# EAGLE design DDSBeeTQFP (EAGLE 6.4)
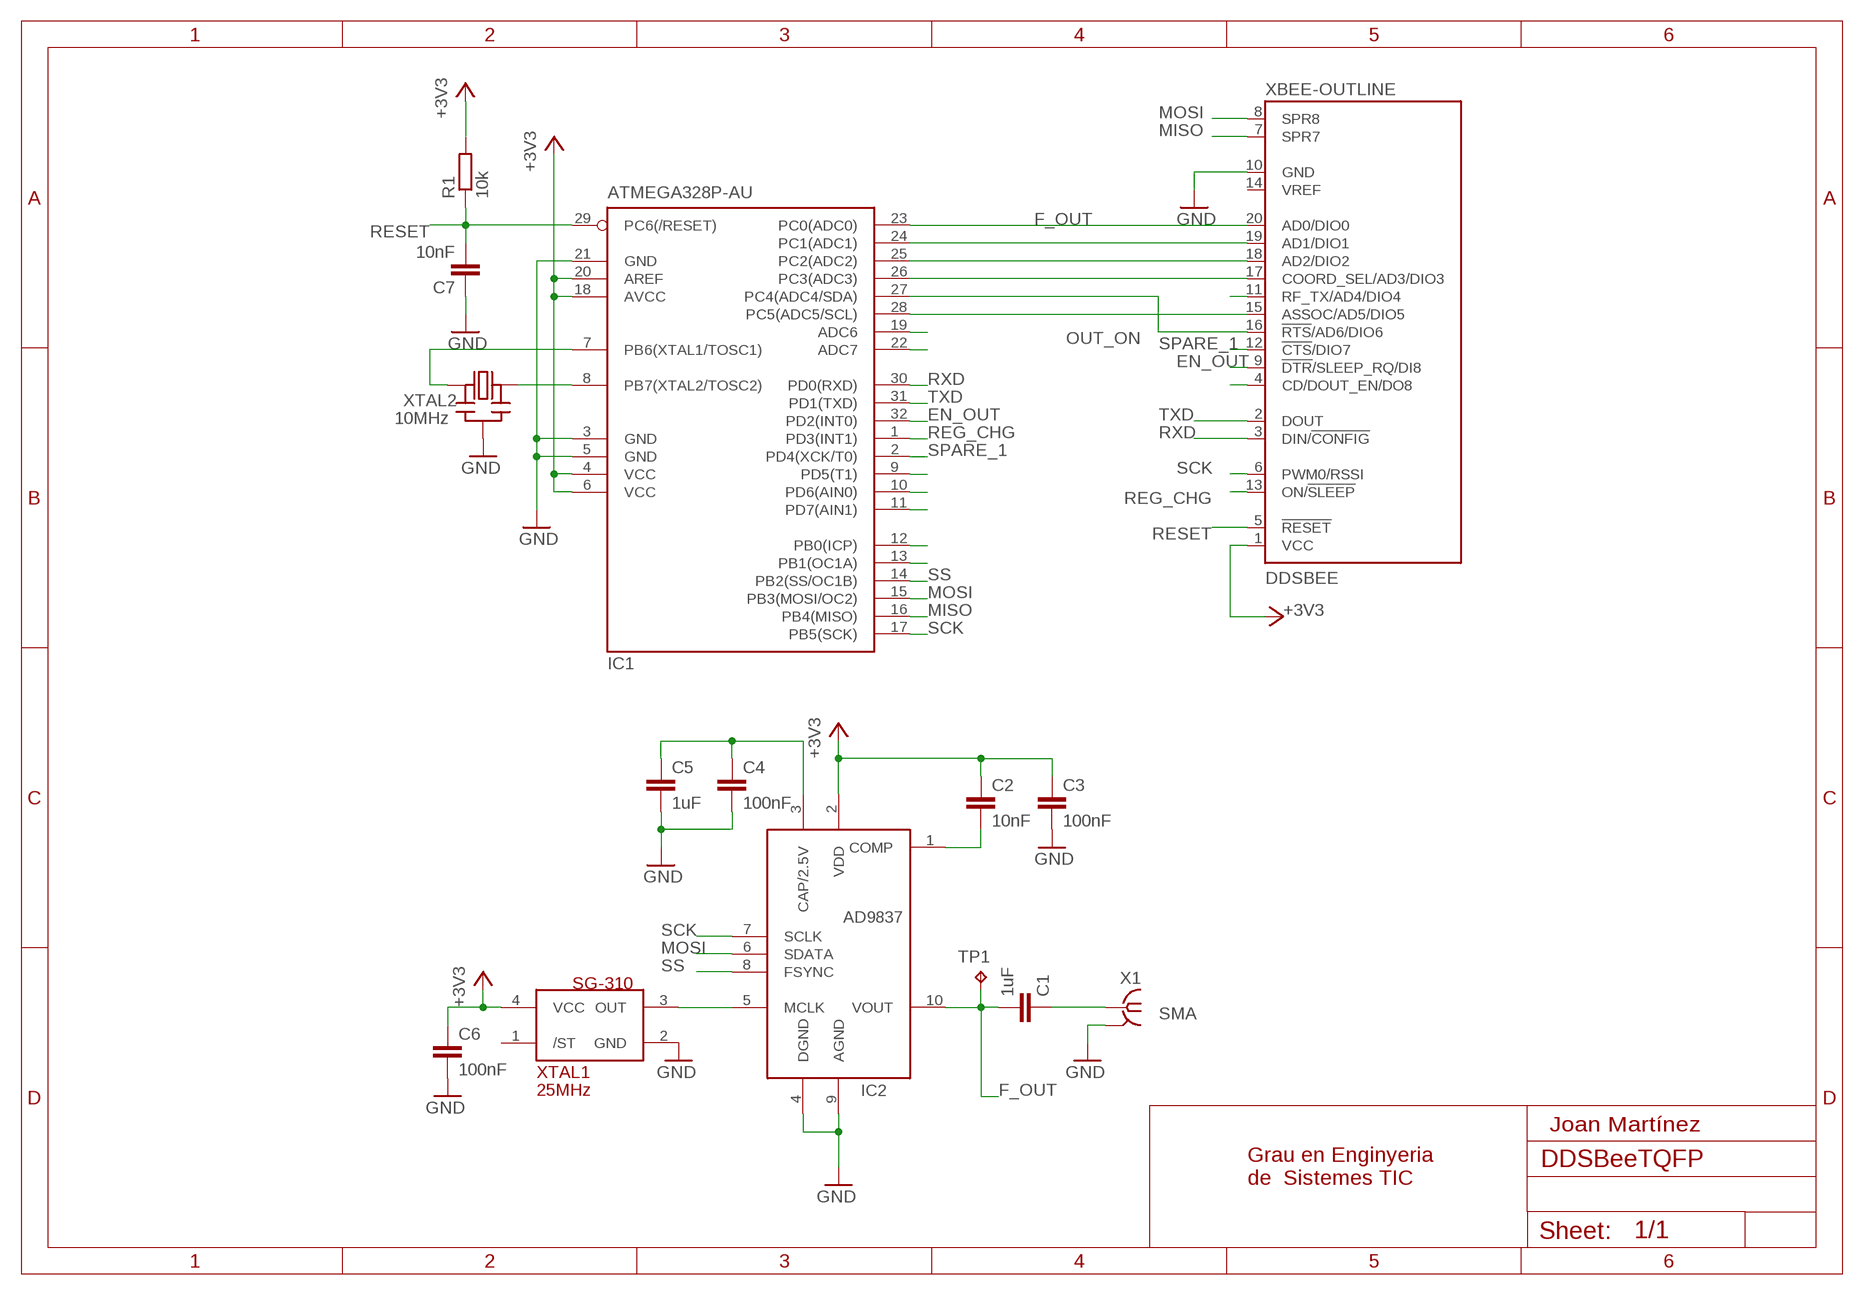
[diagram p0: schematic, sheet 1]

## Parts
C1  1uF  C-EUC0805  [C0805]
C2  10nF  C-EUC0805  [C0805]
C3  100nF  C-EUC0805  [C0805]
C4  100nF  C-EUC0805  [C0805]
C5  1uF  C-EUC0805  [C0805]
C6  100nF  C-EUC0805  [C0805]
C7  10nF  C-EUC0805  [C0805]
DDSBEE  XBEE-OUTLINE  [XBEE-PRO-DIM]
IC1  ATMEGA328P-AU  MEGA8-AI  [TQFP32-08]
IC2  AD9833  [MSOP10]
R1  10k  R-EU_R0805  [R0805]
TP1  TPTP15R  [TP15R]
X1  SMA  SMA-142-0701-871/876  [J502-ND-142-0701-871/876]
XTAL1  25MHz  SG-310-SCN  [EF241A]
XTAL2  10MHz  CERMOSCILL-CERALOCK  [CERALOCK]

## Nets
+3V3: C2.1 C3.1 C6.1 DDSBEE.1(VCC) IC1.4(VCC) IC1.6(VCC) IC1.18(AVCC) IC1.20(AREF) IC2.2(VDD) R1.2 XTAL1.4(VCC)
EN_OUT: DDSBEE.9(!DTR!/SLEEP_RQ/DI8) IC1.32(PD2(INT0))
F_CON: C1.1 X1.1
F_OUT: C1.2 DDSBEE.20(AD0/DIO0) IC1.23(PC0(ADC0)) IC2.10(VOUT) TP1.TP
GND: C3.2 C4.2 C5.2 C6.2 C7.1 DDSBEE.10(GND) IC1.3(GND) IC1.5(GND) IC1.21(GND) IC2.4(DGND) IC2.9(AGND) X1.G@1(GND) XTAL1.2(GND) XTAL2.P$2(GND)
MISO: DDSBEE.7(SPR7) IC1.16(PB4(MISO))
MOSI: DDSBEE.8(SPR8) IC1.15(PB3(MOSI/OC2)) IC2.6(SDATA)
N$2: IC1.8(PB7(XTAL2/TOSC2)) XTAL2.P$3(IN)
N$3: C2.2 IC2.1(COMP)
N$4: IC1.13(PB1(OC1A))
N$5: C4.1 C5.1 IC2.3(CAP/2.5V)
N$6: IC1.7(PB6(XTAL1/TOSC1)) XTAL2.P$1(OUT)
N$7: IC2.5(MCLK) XTAL1.3(OUT)
N$11: IC1.9(PD5(T1))
N$12: IC1.10(PD6(AIN0))
N$13: IC1.11(PD7(AIN1))
N$14: IC1.12(PB0(ICP))
N$21: DDSBEE.15(ASSOC/AD5/DIO5) IC1.28(PC5(ADC5/SCL))
N$22: IC1.19(ADC6)
N$23: IC1.22(ADC7)
N$25: DDSBEE.19(AD1/DIO1) IC1.24(PC1(ADC1))
N$26: DDSBEE.18(AD2/DIO2) IC1.25(PC2(ADC2))
N$27: DDSBEE.17(COORD_SEL/AD3/DIO3) IC1.26(PC3(ADC3))
N$28: DDSBEE.11(RF_TX/AD4/DIO4)
N$33: DDSBEE.4(CD/DOUT_EN/DO8)
OUT_ON: DDSBEE.16(!RTS!/AD6/DIO6) IC1.27(PC4(ADC4/SDA))
REG_CHG: DDSBEE.13(ON/!SLEEP) IC1.1(PD3(INT1))
RESET: C7.2 DDSBEE.5(!RESET) IC1.29(PC6(/RESET)) R1.1
RXD: DDSBEE.3(DIN/!CONFIG) IC1.30(PD0(RXD))
SCK: DDSBEE.6(PWM0/RSSI) IC1.17(PB5(SCK)) IC2.7(SCLK)
SPARE_1: DDSBEE.12(!CTS!/DIO7) IC1.2(PD4(XCK/T0))
SS: IC1.14(PB2(SS/OC1B)) IC2.8(FSYNC)
TXD: DDSBEE.2(DOUT) IC1.31(PD1(TXD))
Unconnected: DDSBEE.14(VREF) XTAL1.1(/ST)

## Notes on the sheet
- Joan Martínez
- Grau en Enginyeria 
  de  Sistemes TIC

## Power pins joined to a net without a drawn wire
GND: X1.G@2(GND) X1.G@3(GND) X1.G@4(GND)

## Library data of the parts
C1-C6 = rcl:C-EU: CAPACITOR, European symbol
C7 = resistor:C-EU: CAPACITOR, European symbol
DDSBEE = mylib:XBEE-OUTLINE: XBee (TM) /XBee-PRO(TM) OEM RF Modules Source: MaxStream, Inc. xbee_productmanual.pdf
IC1 = atmel:MEGA8: MICROCONTROLLER 8 Kbytes FLASH, 1 kbytes SRAM, 512 bytes EEPROM, USART, 6-channel 10 bit ADC, 2-channel 8 bit ADC Pin compatible with Atmega48, ATMega88, ATMega168 Source: avr.lbr; MPN: ATMEGA8-16AU; OC_FARNELL: 9171371; OC_NEWARK: 73M8863
IC2 = bitinnova:AD9833: DDS AD9833 Low Power, 12.65 mW, 2.3 V to 5.5 V, Programmable Waveform Generator 0 MHz to 12.5 MHz output frequency range 28-bit resolution: 0.1 Hz at 25 MHz reference clock Sinusoidal, triangular, and square wave outputs 2.3 V to 5.5 V power supply
R1 = resistor:R-EU_: RESISTOR, European symbol
TP1 = testpad:TP: Test pad
X1 = con-coax:SMA-: SMA 50 Ohm End Launch Jack Receptacle - Round Contact Johnson Components Source: www.johnsoncomponents.com .. J502-ND.pdf; MF: JOHNSON COMPONENTS; MPN: 142-0701-871; OC_FARNELL: 1339835; OC_NEWARK: 91B6105
XTAL1 = bitinnova:SG-310-SCN: SG - 310 series CRYSTAL OSCILLATOR SPXO 3.3V
XTAL2 = adafruit:CERMOSCILL: Ceramic oscillator with built in capacitors such as ZTT-12MHz http://www.ladyada.net/library/eagle

## Board
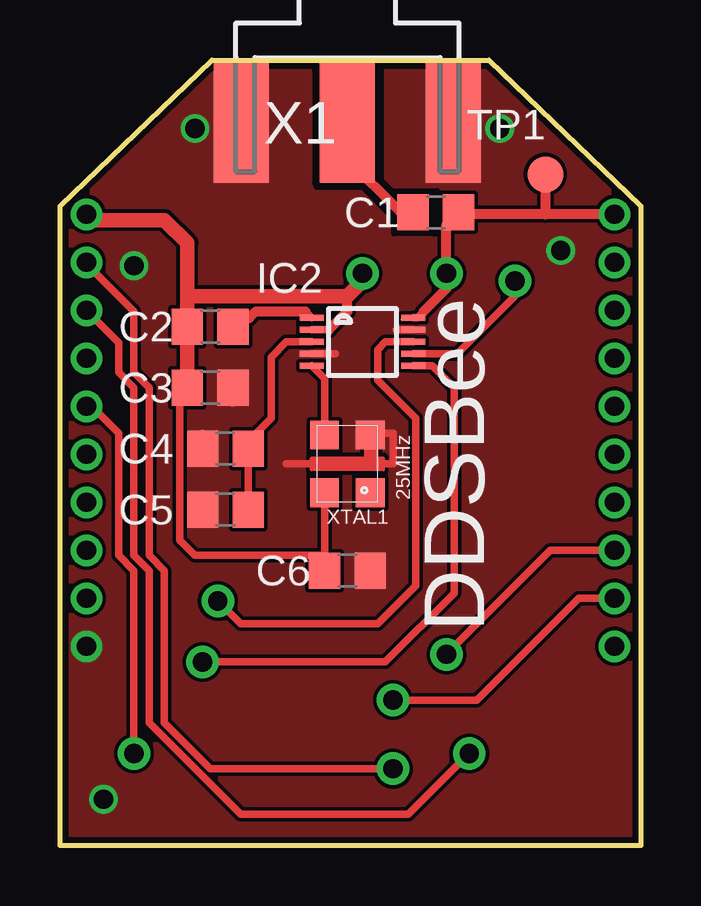
[diagram p1: board, top side]
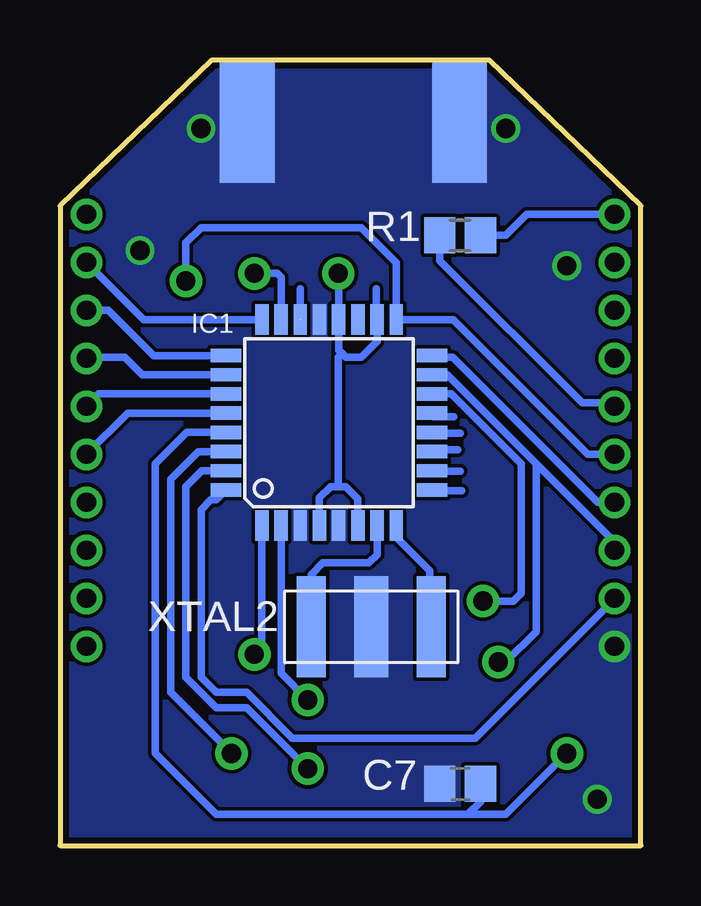
[diagram p2: board, bottom side, seen from below]

Size 24.2 x 32.74 mm. Coordinates in mm from the lower left corner, seen from the top.
Copper layers (1*16): Top 0.035mm / dielectric 1.5mm / Bottom 0.035mm
Design rules "Fusion_eagle_rule_v1.1": minimum track width 6mil, minimum drill 12mil, track to track 6mil, track to pad 6mil, pad to pad 6mil, via to via 6mil, smd to smd 0mil, copper to edge 10mil, drill to drill 10mil, minimum pad ring 10mil, minimum via ring 6mil, stop-mask expansion 2mil, vias tented up to drill 100mil, thermal gap 10mil
tRestrict: 8 lines

### Footprints (pad centres in the part's own frame; a part is rotated, then mirrored left to right if it is on the bottom)
C0805 = smd 1.3 x 1.5: 1 -0.95,0; 2 0.95,0
C0805' = smd 1.3 x 1.5: 1 -0.85,0; 2 0.85,0
XBEE-PRO-DIM = drill 0.8 pad 1.27: 1 -11,9; 2 -11,7; 3 -11,5; 4 -11,3; 5 -11,1; 6 -11,-1; 7 -11,-3; 8 -11,-5; 9 -11,-7; 10 -11,-9; 11 11,-9; 12 11,-7; 13 11,-5; 14 11,-3; 15 11,-1; 16 11,1; 17 11,3; 18 11,5; 19 11,7; 20 11,9
TQFP32-08 = smd 1.27 x 0.559: 1 -4.293,2.8; 2 -4.293,2; 3 -4.293,1.2; 4 -4.293,0.4; 5 -4.293,-0.4; 6 -4.293,-1.2; 7 -4.293,-2; 8 -4.293,-2.8; 17 4.293,-2.8; 18 4.293,-2; 19 4.293,-1.2; 20 4.293,-0.4; 21 4.293,0.4; 22 4.293,1.2; 23 4.293,2; 24 4.293,2.8 | smd 0.559 x 1.27: 9 -2.8,-4.293; 10 -2,-4.293; 11 -1.2,-4.293; 12 -0.4,-4.293; 13 0.4,-4.293; 14 1.2,-4.293; 15 2,-4.293; 16 2.8,-4.293; 25 2.8,4.293; 26 2,4.293; 27 1.2,4.293; 28 0.4,4.293; 29 -0.4,4.293; 30 -1.2,4.293; 31 -2,4.293; 32 -2.8,4.293
MSOP10 = smd 0.25 x 1: 1 -1,-2.113; 2 -0.5,-2.113; 3 0,-2.113; 4 0.5,-2.113; 5 1,-2.113; 6 1,2.113; 7 0.5,2.113; 8 0,2.113; 9 -0.5,2.113; 10 -1,2.113
R0805 = smd 1.3 x 1.5: 1 -0.85,0; 2 0.85,0
TP15R = smd 1.5 x 1.5: TP 0,0
J502-ND-142-0701-871/876 = smd 5.08 x 2.286: 1 2.565,0; G@1 2.565,4.42; G@2 2.565,-4.42 | smd 5.08 x 2.286 bottom: G@3 2.565,4.42; G@4 2.565,-4.42
EF241A = smd 1.2 x 1.2: 1 -1.2,-0.95; 2 1.2,-0.95; 3 1.2,0.95; 4 -1.2,0.95
CERALOCK = smd 1.2 x 4.2: P$1 -2.71,-0.44; P$3 2.29,-0.44 | smd 1.4 x 4.2: P$2 -0.21,-0.44

### Placement (x,y rotation side)
C1  15.66,26.39 0 top
C2  6.26,21.62 0 top
C3  6.26,19.08 0 top
C4  6.89,16.54 180 top
C5  6.89,14 180 top
C6  11.97,11.46 0 top
C7  10nF  [C0805']  7.53,2.57 0 bottom
DDSBEE  12.1,17.3 0 top
IC1  12.99,17.62 90 bottom
IC2  12.61,20.99 270 top
R1  7.53,25.43 0 bottom
TP1  20.23,27.97 0 top
X1  11.97,32.74 270 top
XTAL1  11.97,15.91 90 top
XTAL2  11.02,9.56 0 bottom

### Tracks (layer width: path | path; a pad name or v marks a point on that pad's centre or on a via)
+3V3  (via drill 0.8 pad 1.35)
  Top 0.305: IC2.2 11.2,21.49 | C6.1 11.02,12.1 | 11.02,12.1 XTAL1.4 | C3.1 4.99,18.76 4.99,12.73 5.62,12.1 11.02,12.1
  Top 0.406: 11.2,21.49 11.97,22.26 11.97,22.89
  Top 0.61: 5.31,22.89 C2.1 C3.1 | 5.31,22.89 5.31,25.11 4.35,26.07 1.34,26.07 DDSBEE.1 | 5.31,22.89 11.97,22.89 12.61,23.53 v12.61,23.85
  Bottom 0.305: R1.2 5.62,25.43 4.75,26.3 DDSBEE.1 | IC1.6 11.79,14.45 12.29,14.96 12.61,14.96 | IC1.4 13.39,14.49 12.93,14.96 12.61,14.96 | 12.45,20.51 12.59,20.65 IC1.20 | 12.45,20.51 12.29,20.35 11.66,20.35 10.99,21.02 IC1.18 11.02,21.95 11.02,23.21 | 12.61,14.96 12.61,20.35 12.45,20.51 | 12.61,21.93 IC1.20 | IC1.20 12.59,23.83 v12.61,23.85
EN_OUT
  Bottom 0.305: DDSBEE.9 1.1,10.27 6.89,4.48 14.51,4.48 16.42,6.38 17.69,6.38 18.32,7.02 18.32,14 17.91,14.42 17.69,14.42 IC1.32
F_CON
  Top 0.406: 11.97,28.17 11.97,28.61 | 11.97,28.61 X1.1 | C1.1 14.2,26.39 11.97,28.61
F_OUT  (via drill 0.8 pad 1.35)
  Top 0.305: 16.1,25.88 C1.2 | IC2.10 14.88,21.99 15.46,22.58
  Top 0.406: DDSBEE.20 20.23,26.3 | TP1.TP 20.23,26.3 | 20.23,26.3 16.69,26.3 C1.2 | 16.1,25.88 v16.1,23.85 16.1,23.21 15.46,22.58 15.15,22.26
  Bottom 0.305: IC1.23 14.99,23.69 15.15,23.85 v16.1,23.85
GND  (via drill 0.8)
  Top 0.305: X1.G@4 7.55,29.22 | IC2.4 11.47,20.49 | 7.21,18.44 C3.2 6.89,19.08 | 12.92,17.5 XTAL1.2 12.99,17.18 13.88,17.18 13.88,15.91 9.43,15.91 | IC2.9 14.01,21.49 | C4.2 5.94,17.18
  other vias: 1.81,1.94 20.86,24.8 3.08,24.16 5.62,29.88 18.32,29.88
  pour Top (no thermals): -0.09,33.05 24.04,42.58 24.67,0.03 -0.09,0.03
  pour Bottom (no thermals): 6.26,33.05 24.67,33.05 24.67,0.03 -0.09,0.03 -0.09,33.05
MISO
  Bottom 0.305: DDSBEE.7 1.8,14.31 7.85,20.35 8.63,20.35 IC1.16
MOSI  (via drill 0.8 pad 1.35)
  Top 0.305: v5.94,7.65 13.56,7.65 16.42,10.51 16.42,19.08 15.51,19.99 IC2.6
  Bottom 0.305: v5.94,7.65 5.62,7.65 4.35,8.92 4.35,15.91 | IC1.15 8.07,19.62 4.35,15.91 | DDSBEE.8 1.1,12.66 4.35,15.91
N$2
  Bottom 0.305: IC1.8 10.19,12.85 8.8,11.46 8.8,9.19 XTAL2.P$3
N$3
  Top 0.305: C2.2 7.57,21.99 7.89,21.99 | 10.22,22.26 IC2.1
  Top 0.406: 7.89,21.99 8.16,22.26 10.22,22.26
N$4
  Bottom 0.305: 7.79,17.86 8.65,17.86 8.7,17.91 IC1.13
N$5
  Top 0.305: C5.1 C4.1 7.84,16.86 8.8,17.81 8.8,20.35 9.43,20.99 IC2.3
N$6
  Bottom 0.305: IC1.7 10.99,12.13 11.34,11.78 13.24,11.78 13.73,11.29 XTAL2.P$1
N$7
  Top 0.305: XTAL1.3 11.02,19.46 IC2.5
N$11
  Bottom 0.305: 7.45,14.78 8.48,14.78 8.53,14.82 IC1.9
N$12
  Bottom 0.305: 7.53,15.59 8.48,15.59 8.51,15.62 IC1.10
N$13
  Bottom 0.305: 8.77,16.49 7.62,16.49 | 8.82,16.49 8.77,16.49 | 8.77,16.49 IC1.11
N$14
  Bottom 0.305: 7.53,17.18 8.48,17.18 8.53,17.22 IC1.12
N$21
  Bottom 0.305: IC1.28 21.38,18.02 DDSBEE.15
N$23  (1 unrouted)
  Bottom 0.305: 14.2,21.94 14.2,23.21
N$25
  Bottom 0.305: DDSBEE.19 20.71,21.92 IC1.24
N$26
  Bottom 0.305: DDSBEE.18 22.18,22.3 20.3,20.42 IC1.25
N$27
  Bottom 0.305: IC1.26 20.77,19.62 21.5,20.35 23.05,20.35 DDSBEE.17
OUT_ON
  Bottom 0.305: IC1.27 22.58,18.82 DDSBEE.16
REG_CHG  (via drill 0.8 pad 1.35)
  Top 0.305: DDSBEE.13 20.44,12.31 v16.1,7.97
  Bottom 0.305: IC1.1 15.79,8.28 v16.1,7.97
RESET  (via drill 0.8 pad 1.35)
  Top 0.305: DDSBEE.5 1.32,18.3 2.45,17.18 2.45,12.1 3.08,11.46 v3.08,3.84
  Bottom 0.305: 7.21,1.3 17.69,1.3 20.23,3.84 20.23,15.91 18.91,17.22 IC1.29 | 6.68,3.11 C7.2 6.68,1.84 7.21,1.3 | 7.21,1.3 5.62,1.3 v3.08,3.84 | R1.1 8.38,24.38 2.45,18.45 1.24,18.45 DDSBEE.5
RXD  (via drill 0.8 pad 1.35)
  Top 0.305: v17.05,3.84 14.51,1.3 7.53,1.3 3.72,5.11 3.72,11.46 3.08,12.1 3.08,19.08 2.45,19.72 2.45,20.96 DDSBEE.3
  Bottom 0.305: IC1.30 18.44,16.42 19.59,15.27 19.59,6.38 v17.05,3.84
SCK  (via drill 0.8 pad 1.35)
  Top 0.305: IC2.7 16.55,20.49 18.96,22.89 v18.96,23.53
  Bottom 0.305: 18.96,24.16 v18.96,23.53 18.96,25.12 18.32,25.75 11.66,25.75 10.19,24.28 IC1.17 7.82,21.92 2.21,16.3 DDSBEE.6
SPARE_1  (via drill 0.8 pad 1.35)
  Top 0.305: v13.88,6.07 17.37,6.07 21.61,10.31 DDSBEE.12
  Bottom 0.305: v13.88,6.07 14.99,7.18 IC1.2
SS  (via drill 0.8 pad 1.35)
  Top 0.305: IC2.8 13.56,20.99 13.24,20.67 13.24,19.4 14.83,17.81 14.83,10.83 13.24,9.24 7.53,9.24 v6.58,10.19
  Bottom 0.305: IC1.14 7.9,18.82 4.99,15.91 4.99,10.51 5.3,10.19 v6.58,10.19
TXD  (via drill 0.8 pad 1.35)
  Top 0.305: v13.88,3.21 6.26,3.21 4.35,5.11 4.35,11.46 3.72,12.1 3.72,19.08 3.08,19.72 3.08,22.26 1.1,24.24 DDSBEE.2
  Bottom 0.305: IC1.31 18.29,15.62 18.96,14.96 18.96,7.02 17.69,5.75 16.42,5.75 v13.88,3.21

### Text on the board
tPlace: DDSBee